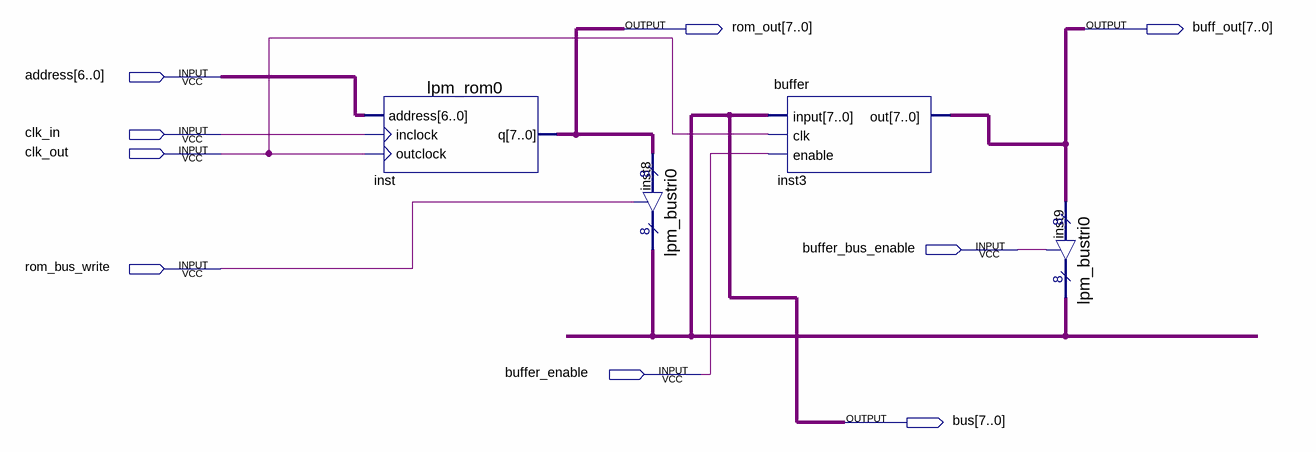
[diagram p0: schematic sheet]
// Quartus schematic test.bdf as structural Verilog: 4 symbols, 9 pins
module test (
  input  [6:0] address,
  input  clk_in,
  input  clk_out,
  input  buffer_bus_enable,
  input  rom_bus_write,
  input  buffer_enable,
  output [7:0] rom_out,
  output [7:0] buff_out,
  output [7:0] bus
);

  lpm_rom0 inst (.address(address), .inclock(clk_in), .outclock(clk_out), .q(rom_out));
  lpm_bustri0 inst8 (.enabledt(rom_bus_write), .data(rom_out), .tridata(bus));
  buffer inst3 (.\input (bus), .clk(clk_out), .enable(buffer_enable), .out(buff_out));
  lpm_bustri0 inst9 (.enabledt(buffer_bus_enable), .data(buff_out), .tridata(bus));
endmodule
